# Altium schematic sheet Sheet1.SchDoc: Zasilacz DC
size A4; Author: Jakub Zajączkowski; Address1: 3-26V; Revision: 1; ProjectName: Zasilacz
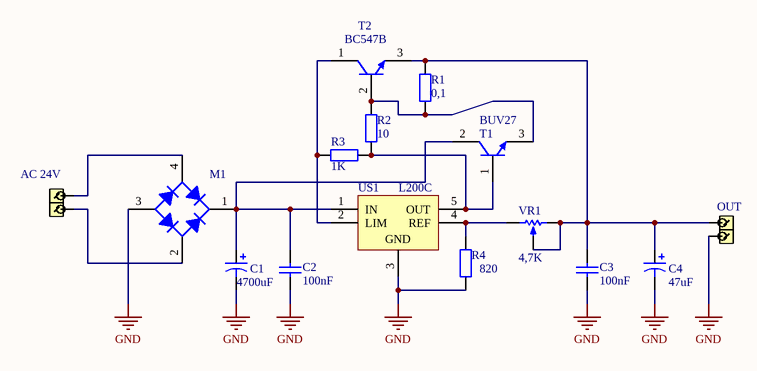
[diagram p0: Sheet1.SchDoc]

## Parts
AC_24V  k  [ARK2]  (value not drawn)
C1  value 4700uF  [CAPPR7.5-16x20]  (hidden comment: Cap Pol1)
C2  value 100nF  [CAPR2.54-5.1x2.5]  (hidden comment: Cap Semi)
C3  value 100nF  [CAPR2.54-5.1x2.5]  (hidden comment: Cap Semi)
C4  value 47uF  [CAPPR5-6.3x15]  (hidden comment: Cap Pol1)
M1  Bridge1  [D-38]  (value not drawn)
OUT  ARK  [ARK2]  (value not drawn)
R1  value 0,1  [RES17.7-14X6.5]  (hidden comment: Res2)
R2  value 10  [AXIAL-0.4]  (hidden comment: Res2)
R3  value 1K  [AXIAL-0.4]  (hidden comment: Res2)
R4  value 820  [AXIAL-0.4]  (hidden comment: Res2)
T1  BUV27  [ONSC-TO-220-3-221A-09]
T2  BC547B  [ONSC-TO-92-3-29-11]
US1  L200C  [PentawattV]
VR1  value 4,7K  [VR5]  (hidden comment: RPot)

## Nets
GND: C1.2 C2.1 C3.1 C4.2 M1.3(A) OUT.1 R4.1 US1.3(GND)
NetAC_24V_1: AC_24V.1 M1.4(C)
NetAC_24V_2: AC_24V.2 M1.2(C)
NetC1_1: C1.1 C2.2 M1.1(K) T1.2(C) US1.1(IN)
NetC3_2: C3.2 C4.1 OUT.2 R1.1 T2.3(E) VR1.2(BOT) VR1.3(TAP)
NetR1_2: R1.2 R2.2 T1.3(E) T2.2(B)
NetR2_1: R2.1 R3.1 T1.1(B) US1.5(OUT)
NetR3_2: R3.2 T2.1(C) US1.2(LIM)
NetR4_2: R4.2 US1.4(REF) VR1.1(TOP)

## Notes on the sheet
- Title
- Size:
- Date:
- A4
- Number:
- Time:
- Revision:
- Sheet
- of
- File:

## Library data of the parts
AC_24V = ARK
C1 C4 = Cap Pol1: Polarized Capacitor (Radial); Published: 8-Jun-2000; LatestRevisionDate: 17-Jul-2002; LatestRevisionNote: Re-released for DXP Platform.; PackageReference: RB7.6-15; Publisher: Altium Limited; PackageDescription: Polarized Capacitor (Radial); 2 Leads
C2 C3 = Cap Semi: Capacitor (Semiconductor SIM Model); Published: 8-Jun-2000; LatestRevisionDate: 29-May-2009; LatestRevisionNote: IPC-7351 Footprint Added.; PackageReference: C1206; Publisher: Altium Limited; PackageDescription: Chip Capacitor
M1 = Bridge1: Full Wave Diode Bridge; Published: 8-Jun-2000; LatestRevisionDate: 29-May-2009; LatestRevisionNote: Sch pins A & K swapped.; DatasheetVersion: E2732B; PackageReference: D-38; Publisher: Altium Limited; PackageDescription: Bridge Rectifier; 4 Terminals; Body 9.4 x 9.4 mm (typ); Pitch 5.08 mm
R1-R4 = Res2: Resistor; Published: 8-Jun-2000; LatestRevisionDate: 17-Jul-2002; LatestRevisionNote: Re-released for DXP Platform.; PackageReference: AXIAL-0.4; Publisher: Altium Limited; PackageDescription: Axial Device, Thru-Hole; 2 Leads; 0.4 in Pin Spacing
T1 = BUV27: NPN Silicon Power Transistor, 3-Pin TO-220, Tube; Manufacturer: On Semiconductor; Note: 0; IC Continuous (A): 12; DatasheetVersion: Rev. 3; PackageVersion: Rev. AG, 09/2011; PackageReference: TO-220-3-221A-09; PackageDescription: 3-Pin Flange Mount, Vertical Straight Lead, Body 9.97 x 4.445 mm, Pitch 2.54 mm; Packing: Tube; Polarity: NPN; RoHS: FALSE; Mounting Technology: Through Hole; PartNumber: BUV27; ComponentLink1Description: Manufacturer URL; ComponentLink1URL: http://www.onsemi.com/; ComponentLink2Description: Datasheet; ComponentLink2URL: http://www.onsemi.com/pub_link/Collateral/BUV27-D.PDF; ComponentLink3Description: Package Specification; ComponentLink3URL: http://www.onsemi.com/pub_link/Collateral/221A-09.PDF
T2 = BC547B: Amplifier Transistor, NPN Silicon, 3-Pin TO-92, Bulk Box; Manufacturer: On Semiconductor; fT Min (MHz): 150; IC Continuous (A): 0.1; DatasheetVersion: Rev. 7; PackageVersion: Rev. AM; PackageReference: TO-92-3-29-11_AM_SL; PackageDescription: 3-Pin Transistor Outline, Body 4.825 x 3.685 mm, Pitch 1.27 mm; Supplier 1: Digi-Key; Supplier Part Number 1: BC547BOS-ND; Packing: Bulk Box; Polarity: NPN; RoHS: FALSE; Mounting Technology: Through Hole; PartNumber: BC547B; ComponentLink1Description: Manufacturer URL; ComponentLink1URL: http://www.onsemi.com/; ComponentLink2Description: Datasheet; ComponentLink2URL: http://www.onsemi.com/pub_link/Collateral/BC546-D.PDF; ComponentLink3Description: Package Specification; ComponentLink3URL: http://www.onsemi.cn/pub_link/Collateral/2N6426-D.PDF
US1 = L200CV: Adjustable Voltage and Current Regulator, 5-Pin Pentawatt, Tube; DatasheetVersion: Jan-2000; PackageVersion: Feb-2004; PackageReference: PentawattV; PackageDescription: TO, Thru-Hole, Vertical, Heatsink Mounted; 5 Bent Staggered Leads; Pitch 1.7 mm; PartNumber: L200CV; ComponentLink1Description: Manufacturer URL; ComponentLink1URL: http://www.st.com; ComponentLink2Description: Datasheet; ComponentLink2URL: http://www.st.com/internet/com/TECHNICAL_RESOURCES/TECHNICAL_LITERATURE/DATASHEET/CD00000053.pdf; ComponentLink3Description: Package Specification; ComponentLink3URL: http://www.st.com/internet/com/TECHNICAL_RESOURCES/TECHNICAL_LITERATURE/PACKAGE_INFORMATION/CD00004635.pdf
VR1 = RPot: Potentiometer; Sim Note: Enter the Resistance value and the set point into parameter fields.; Set Position: 0.5; Published: 8-Jun-2000; LatestRevisionDate: 17-Jul-2002; LatestRevisionNote: Re-released for DXP Platform.; PackageReference: VR5; Publisher: Altium Limited; PackageDescription: Variable Resistor, Thru-Hole; 3 Leads